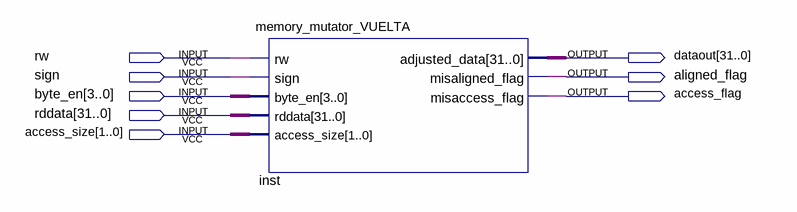
[diagram p0: schematic sheet]
// Quartus schematic VUELTA_test.bdf as structural Verilog: 1 symbols, 8 pins
module VUELTA_test (
  input  rw,
  input  sign,
  input  [3:0] byte_en,
  input  [31:0] rddata,
  input  [1:0] access_size,
  output [31:0] dataout,
  output aligned_flag,
  output access_flag
);

  memory_mutator_VUELTA inst (
    .rw(rw), .sign(sign), .byte_en(byte_en), .rddata(rddata), .access_size(access_size),
    .adjusted_data(dataout), .misaligned_flag(aligned_flag), .misaccess_flag(access_flag));
endmodule
